# Altium schematic sheet LMAT_AMT_MAG.SchDoc
size C
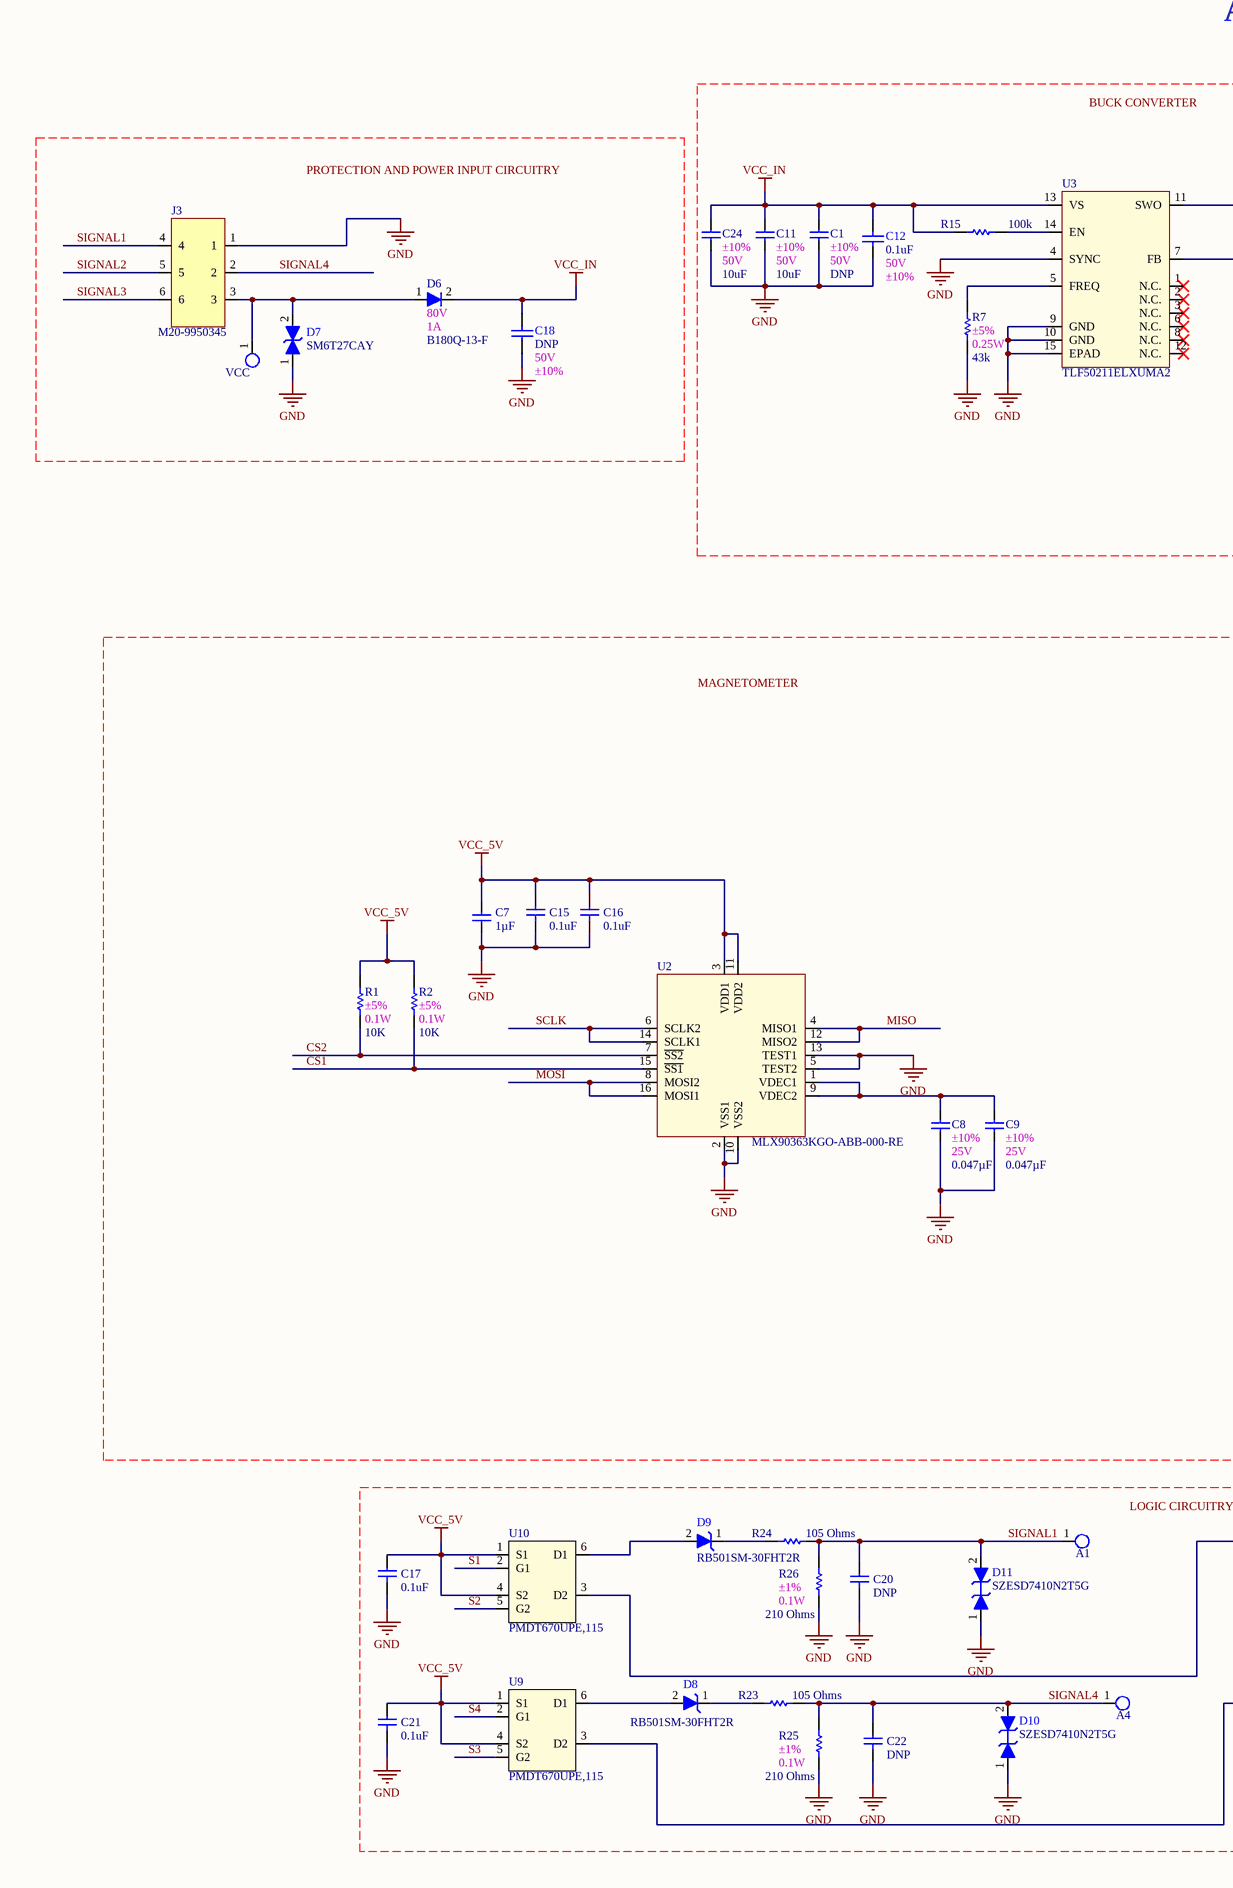
[diagram p0: LMAT_AMT_MAG.SchDoc, left]
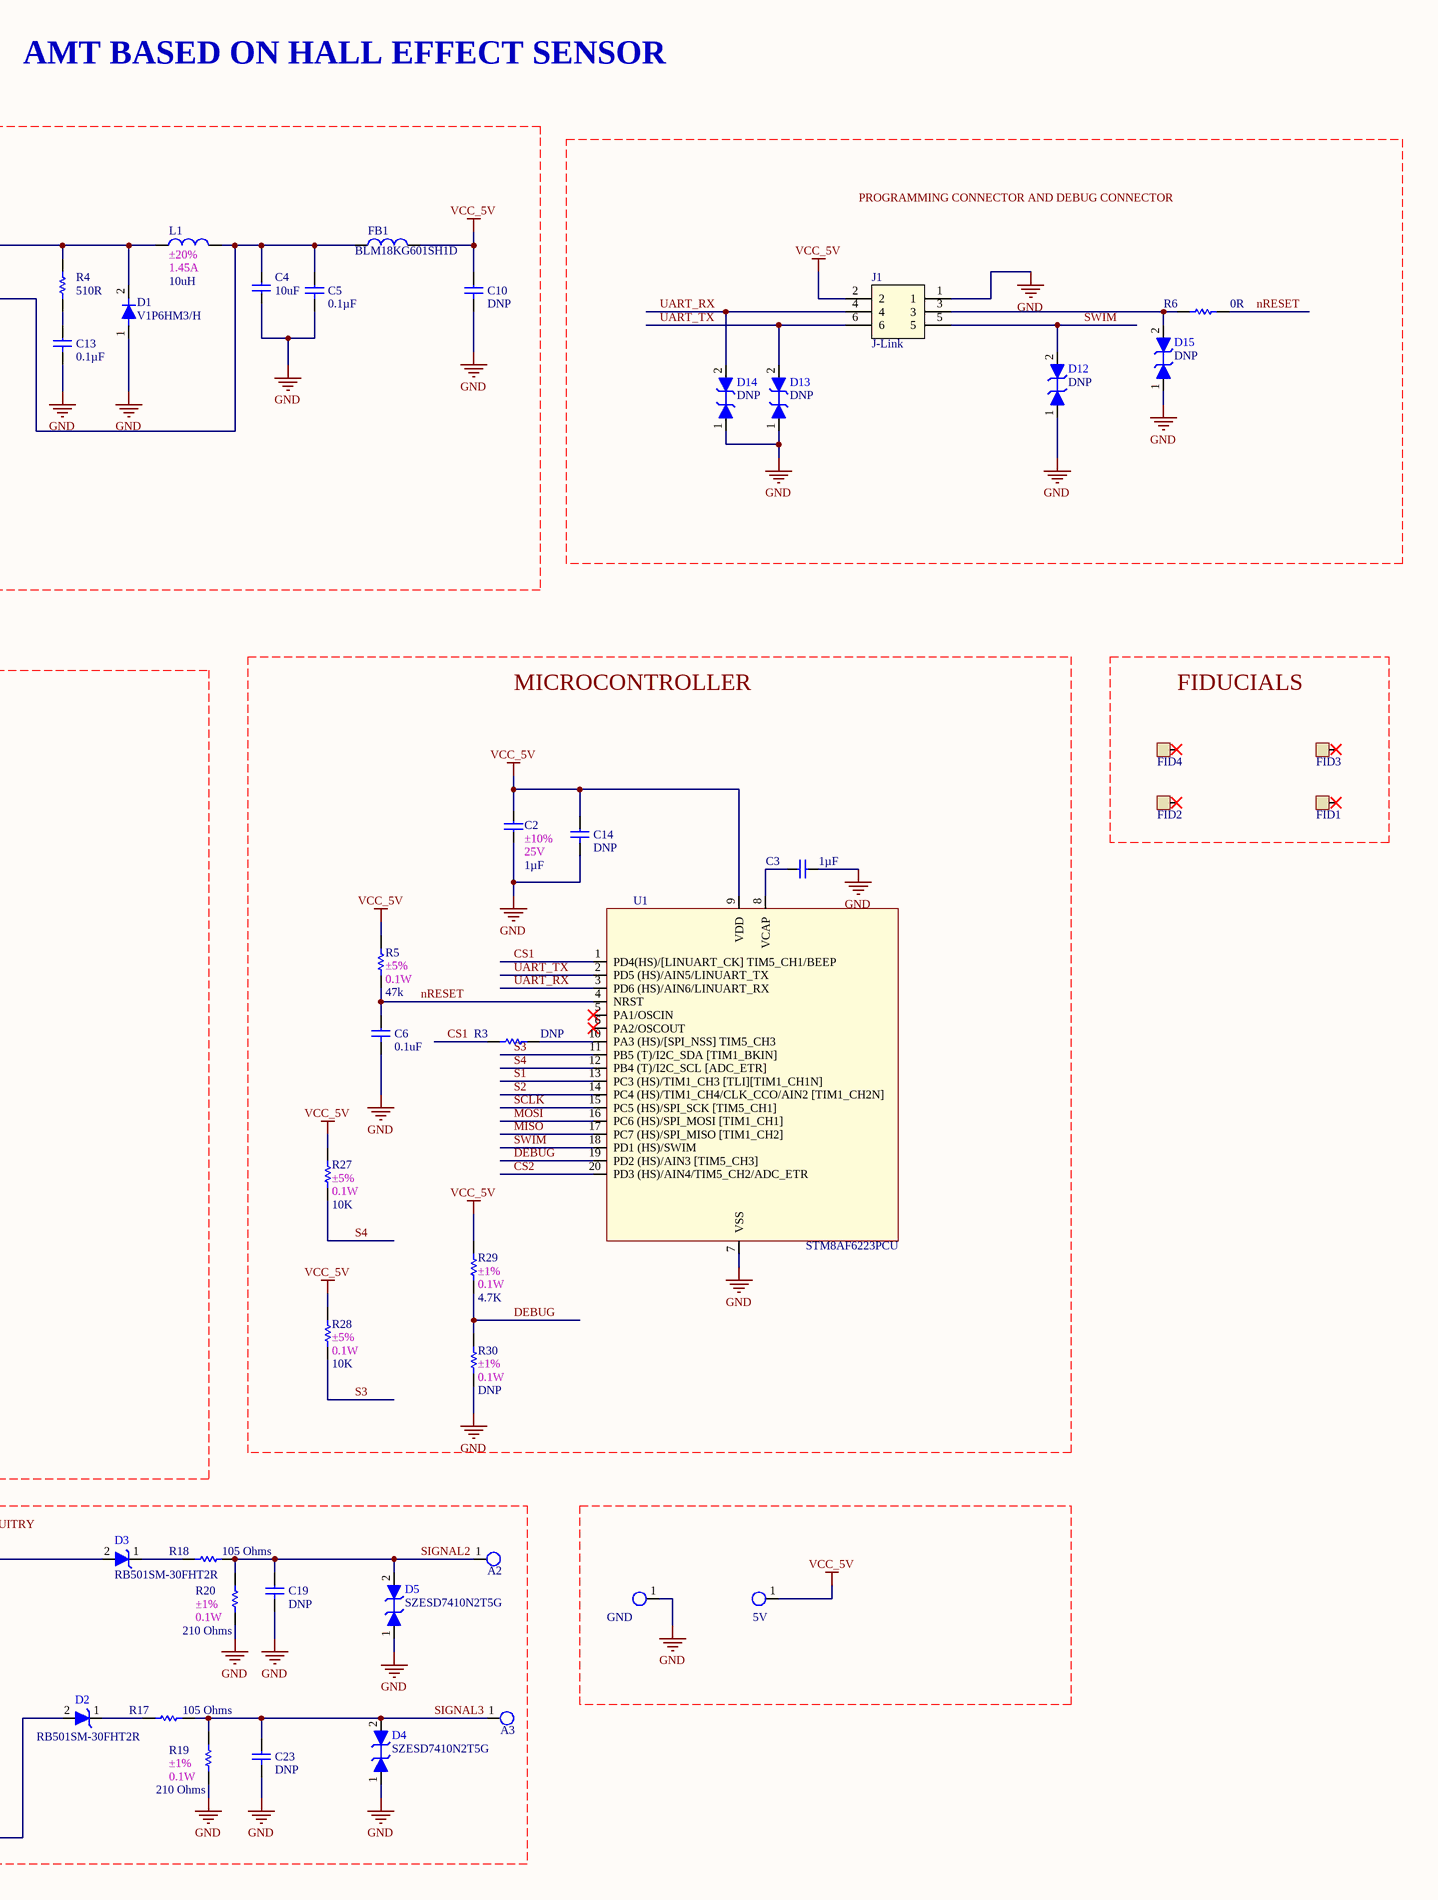
[diagram p1: LMAT_AMT_MAG.SchDoc, right]

## Parts
5V  Test Point- 35mil  [TP_35M_DIA]  (value not drawn)
A1  Test Point- 35mil  [TP_35M_DIA]  (value not drawn)
A2  Test Point- 35mil  [TP_35M_DIA]  (value not drawn)
A3  Test Point- 35mil  [TP_35M_DIA]  (value not drawn)
A4  Test Point- 35mil  [TP_35M_DIA]  (value not drawn)
C1  value DNP  2nd Auxiliary Field: ±10%  1st Auxiliary Field: 50V  [SMDC1210]  (hidden comment: CAP CER 10UF 50V X7R 1210)
C2  value 1µF  2nd Auxiliary Field: ±10%  1st Auxiliary Field: 25V  [SMDC0603]  (hidden comment: CAP CER 1UF 25V X7R 0603)
C3  value 1µF  [SMDC0603]  (hidden comment: CAP CER 1UF 25V X7R 0603)
C4  value 10uF  [SMDC1210]  (hidden comment: CAP CER 10UF 50V X7R 1210)
C5  value 0.1µF  [SMDC0402]  (hidden comment: CAP CER 0.1UF 16V X7R 0402)
C6  value 0.1uF  [SMDC0402]  (hidden comment: CAP CER 0.1UF 16V X7R 0402)
C7  value 1µF  [SMDC0603]  (hidden comment: CAP CER 1UF 25V X7R 0603)
C8  value 0.047µF  2nd Auxiliary Field: ±10%  1st Auxiliary Field: 25V  [SMDC0402]  (hidden comment: CAP CER 0.047UF 25V X7R 0402)
C9  value 0.047µF  2nd Auxiliary Field: ±10%  1st Auxiliary Field: 25V  [SMDC0402]  (hidden comment: CAP CER 0.047UF 25V X7R 0402)
C10  value DNP  [SMDC0402]  (hidden comment: CAP CER 0.1UF 16V X7R 0402)
C11  value 10uF  2nd Auxiliary Field: ±10%  1st Auxiliary Field: 50V  [SMDC1210]  (hidden comment: CAP CER 10UF 50V X7R 1210)
C12  value 0.1uF  1st Auxiliary Field: 50V  2nd Auxiliary Field: ±10%  [SMDC0603]  (hidden comment: CAP CER 0.1UF 50V 10% X7R 0603)
C13  value 0.1µF  [SMDC0402]  (hidden comment: CAP CER 0.1UF 16V X7R 0402)
C14  value DNP  [SMDC0402]  (hidden comment: CAP CER 0.1UF 16V X7R 0402)
C15  value 0.1uF  [SMDC0402]  (hidden comment: CAP CER 0.1UF 16V X7R 0402)
C16  value 0.1uF  [SMDC0402]  (hidden comment: CAP CER 0.1UF 16V X7R 0402)
C17  value 0.1uF  [SMDC0402]  (hidden comment: CAP CER 0.1UF 16V X7R 0402)
C18  value DNP  1st Auxiliary Field: 50V  2nd Auxiliary Field: ±10%  [SMDC0603]  (hidden comment: CAP CER 0.1UF 50V 10% X7R 0603)
C19  value DNP  [SMDC0402]  (hidden comment: CAP CER 0.1UF 16V X7R 0402)
C20  value DNP  [SMDC0402]  (hidden comment: CAP CER 0.1UF 16V X7R 0402)
C21  value 0.1uF  [SMDC0402]  (hidden comment: CAP CER 0.1UF 16V X7R 0402)
C22  value DNP  [SMDC0402]  (hidden comment: CAP CER 0.1UF 16V X7R 0402)
C23  value DNP  [SMDC0402]  (hidden comment: CAP CER 0.1UF 16V X7R 0402)
C24  value 10uF  2nd Auxiliary Field: ±10%  1st Auxiliary Field: 50V  [SMDC1210]  (hidden comment: CAP CER 10UF 50V X7R 1210)
D1  value V1P6HM3/H  [DIOM2213X07N]  (hidden comment: DIODE SCHOTTKY 60V 1A MICROSMP)
D2  value RB501SM-30FHT2R  [SOD1700X70N-V2]  (hidden comment: Diode Schottky 30V 100mA Surface Mount EMD2)
D3  value RB501SM-30FHT2R  [SOD1700X70N-V2]  (hidden comment: Diode Schottky 30V 100mA Surface Mount EMD2)
D4  value SZESD7410N2T5G  [DFN65P100X65X45-2N]  (hidden comment: TVS DIODE 5.5V 14V 2X1SON)
D5  value SZESD7410N2T5G  [DFN65P100X65X45-2N]  (hidden comment: TVS DIODE 5.5V 14V 2X1SON)
D6  value B180Q-13-F  1st Auxiliary Field: 80V  2nd Auxiliary Field: 1A  [DO460X292X240-2N]  (hidden comment: DIODE SCHOTTKY 80V 1A SMA)
D7  value SM6T27CAY  [DIOM4336X26B]  (hidden comment: TVS DIODE 23.1V 48.3V SMB)
D8  value RB501SM-30FHT2R  [SOD1700X70N-V2]  (hidden comment: Diode Schottky 30V 100mA Surface Mount EMD2)
D9  value RB501SM-30FHT2R  [SOD1700X70N-V2]  (hidden comment: Diode Schottky 30V 100mA Surface Mount EMD2)
D10  value SZESD7410N2T5G  [DFN65P100X65X45-2N]  (hidden comment: TVS DIODE 5.5V 14V 2X1SON)
D11  value SZESD7410N2T5G  [DFN65P100X65X45-2N]  (hidden comment: TVS DIODE 5.5V 14V 2X1SON)
D12  value DNP  [DFN65P100X65X45-2N]  (hidden comment: TVS DIODE 5.5V 14V 2X1SON)
D13  value DNP  [DFN65P100X65X45-2N]  (hidden comment: TVS DIODE 5.5V 14V 2X1SON)
D14  value DNP  [DFN65P100X65X45-2N]  (hidden comment: TVS DIODE 5.5V 14V 2X1SON)
D15  value DNP  [DFN65P100X65X45-2N]  (hidden comment: TVS DIODE 5.5V 14V 2X1SON)
FB1  value BLM18KG601SH1D  [SMDL0603]  (hidden comment: FERRITE BEAD 600 OHM 0603 1LN)
FID1  FID40X40  [FID40X40]  (value not drawn)
FID2  FID40X40  [FID40X40]  (value not drawn)
FID3  FID40X40  [FID40X40]  (value not drawn)
FID4  FID40X40  [FID40X40]  (value not drawn)
GND  Test Point- 35mil  [TP_35M_DIA]  (value not drawn)
J1  1st Auxiliary Field: J-Link  [PRG_8.06.16 J-LINK 6-PIN NEEDLE ADAPTER]  (hidden comment: J-LINK 6-PIN NEEDLE ADAPTER)
J3  Manufacturer Part Number: M20-9950345  [HDRRA6W86P254_2X3_1344X254X528P_Modified]  (hidden comment: CONN HEADER R/A 6POS 2.54MM)
L1  value 10uH  2nd Auxiliary Field: ±20%  1st Auxiliary Field: 1.45A  [IND_NRS5030T3R3MMGJ]  (hidden comment: FIXED IND 10UH 1.45A 144 MOHM)
R1  value 10K  2nd Auxiliary Field: ±5%  1st Auxiliary Field: 0.1W  [SMDR0402]  (hidden comment: RES SMD 10K OHM 5% 1/10W 0402)
R2  value 10K  2nd Auxiliary Field: ±5%  1st Auxiliary Field: 0.1W  [SMDR0402]  (hidden comment: RES SMD 10K OHM 5% 1/10W 0402)
R3  value DNP  [SMDR0402]  (hidden comment: RES SMD 0 OHM JUMPER 1/10W 0402)
R4  value 510R  [SMDR0402]  (hidden comment: RES SMD 510 OHM 5% 1/10W 0402)
R5  value 47k  2nd Auxiliary Field: ±5%  1st Auxiliary Field: 0.1W  [SMDR0402]  (hidden comment: RES SMD 47K OHM 5% 1/10W 0402)
R6  value 0R  [SMDR0402]  (hidden comment: RES SMD 0 OHM JUMPER 1/10W 0402)
R7  value 43k  2nd Auxiliary Field: ±5%  1st Auxiliary Field: 0.25W  [SMDR0805]  (hidden comment: RES 43K OHM 5% 1/4W 0805)
R15  value 100k  [SMDR0402]  (hidden comment: RES SMD 100K OHM 1% 1/10W 0402)
R17  value 105 Ohms  [SMDR0603]  (hidden comment: RES SMD 105 OHM 1% 1/10W 0603)
R18  value 105 Ohms  [SMDR0603]  (hidden comment: RES SMD 105 OHM 1% 1/10W 0603)
R19  value 210 Ohms  2nd Auxiliary Field: ±1%  1st Auxiliary Field: 0.1W  [SMDR0603]  (hidden comment: RES SMD 210 OHM 1% 1/10W 0603)
R20  value 210 Ohms  2nd Auxiliary Field: ±1%  1st Auxiliary Field: 0.1W  [SMDR0603]  (hidden comment: RES SMD 210 OHM 1% 1/10W 0603)
R23  value 105 Ohms  [SMDR0603]  (hidden comment: RES SMD 105 OHM 1% 1/10W 0603)
R24  value 105 Ohms  [SMDR0603]  (hidden comment: RES SMD 105 OHM 1% 1/10W 0603)
R25  value 210 Ohms  2nd Auxiliary Field: ±1%  1st Auxiliary Field: 0.1W  [SMDR0603]  (hidden comment: RES SMD 210 OHM 1% 1/10W 0603)
R26  value 210 Ohms  2nd Auxiliary Field: ±1%  1st Auxiliary Field: 0.1W  [SMDR0603]  (hidden comment: RES SMD 210 OHM 1% 1/10W 0603)
R27  value 10K  2nd Auxiliary Field: ±5%  1st Auxiliary Field: 0.1W  [SMDR0402]  (hidden comment: RES SMD 10K OHM 5% 1/10W 0402)
R28  value 10K  2nd Auxiliary Field: ±5%  1st Auxiliary Field: 0.1W  [SMDR0402]  (hidden comment: RES SMD 10K OHM 5% 1/10W 0402)
R29  value 4.7K  2nd Auxiliary Field: ±1%  1st Auxiliary Field: 0.1W  [SMDR0402]  (hidden comment: RES SMD 4.7K OHM 1% 1/10W 0402)
R30  value DNP  2nd Auxiliary Field: ±1%  1st Auxiliary Field: 0.1W  [SMDR0402]  (hidden comment: RES SMD 4.7K OHM 1% 1/10W 0402)
U1  value STM8AF6223PCU  [SOP65P640X120-20N]  (hidden comment: IC MCU 8BIT 8KB FLASH 20TSSOP)
U2  value MLX90363KGO-ABB-000-RE  [SOP65P640X120-16N]  (hidden comment: SENSOR HALL EFFECT SPI 16TSSOP)
U3  value TLF50211ELXUMA2  [SOP65P600X170_HS-15N]  (hidden comment: IC REG DC/DC CONVERTER)
U9  value PMDT670UPE,115  [SOTFL50P160X60-6N]  (hidden comment: MOSFET 2P-CH 20V 0.55A SOT666)
U10  value PMDT670UPE,115  [SOTFL50P160X60-6N]  (hidden comment: MOSFET 2P-CH 20V 0.55A SOT666)
VCC  Test Point- 35mil  [TP_35M_DIA]  (value not drawn)

## Nets
GND: C1.1 C2.1 C3.2 C4.1 C5.1 C6.1 C7.1 C8.1 C9.1 C10.1 C11.1 C12.2 C13.1 C14.1 C15.1 C16.1 C17.1 C18.2 C19.1 C20.1 C21.1 C22.1 C23.1 C24.1 D1.1(Anode) D4.1(ANODE) D5.1(ANODE) D7.1(ANODE) D10.1(ANODE) D11.1(ANODE) D12.1(ANODE) D13.1(ANODE) D14.1(ANODE) D15.1(ANODE) GND.1 J1.1 J3.1 R7.1 R19.2 R20.2 R25.2 R26.2 R30.1 U1.7(VSS) U2.2(VSS1) U2.5(TEST2) U2.10(VSS2) U2.13(TEST1) U3.4(SYNC) U3.9(GND) U3.10(GND) U3.15(EPAD)
VCC_5V: 5V.1 C2.2 C7.2 C10.2 C14.2 C15.2 C16.2 C17.2 C21.2 FB1.2 J1.2 R1.2 R2.2 R5.2 R27.2 R28.2 R29.2 U1.9(VDD) U2.3(VDD1) U2.11(VDD2) U9.1(S1) U9.4(S2) U10.1(S1) U10.4(S2)
VCC_IN: C1.2 C11.2 C12.1 C18.1 C24.2 D6.2(Cathode) R15.2 U3.13(VS)
CS1: R2.1 R3.1 U1.1(PD4(HS)/[LINUART_CK]_TIM5_CH1/BEEP) U2.15(~{SS1})
CS2: R1.1 U1.20(PD3_(HS)/AIN4/TIM5_CH2/ADC_ETR) U2.7(~{SS2})
DEBUG: R29.1 R30.2 U1.19(PD2_(HS)/AIN3_[TIM5_CH3])
MISO: U1.17(PC7_(HS)/SPI_MISO_[TIM1_CH2]) U2.4(MISO1) U2.12(MISO2)
MOSI: U1.16(PC6_(HS)/SPI_MOSI_[TIM1_CH1]) U2.8(MOSI2) U2.16(MOSI1)
nRESET: C6.2 R5.1 R6.2 U1.4(NRST)
S1: U1.13(PC3_(HS)/TIM1_CH3_[TLI][TIM1_CH1N]) U10.2(G1)
S2: U1.14(PC4_(HS)/TIM1_CH4/CLK_CCO/AIN2_[TIM1_CH2N]) U10.5(G2)
S3: R28.1 U1.11(PB5_(T)/I2C_SDA_[TIM1_BKIN]) U9.5(G2)
S4: R27.1 U1.12(PB4_(T)/I2C_SCL_[ADC_ETR]) U9.2(G1)
SCLK: U1.15(PC5_(HS)/SPI_SCK_[TIM5_CH1]) U2.6(SCLK2) U2.14(SCLK1)
SIGNAL1: A1.1 C20.2 D11.2(CATHODE) J3.4 R24.2 R26.1
SIGNAL2: A2.1 C19.2 D5.2(CATHODE) J3.5 R18.2 R20.1
SIGNAL3: A3.1 C23.2 D4.2(CATHODE) J3.6 R17.2 R19.1
SIGNAL4: A4.1 C22.2 D10.2(CATHODE) J3.2 R23.2 R25.1
SWIM: D12.2(CATHODE) J1.5 U1.18(PD1_(HS)/SWIM)
UART_RX: D14.2(CATHODE) J1.4 U1.3(PD6_(HS)/AIN6/LINUART_RX)
UART_TX: D13.2(CATHODE) J1.6 U1.2(PD5_(HS)/AIN5/LINUART_TX)
NetC3_1: C3.1 U1.8(VCAP)
NetC4_2: C4.2 C5.2 FB1.1 L1.2 U3.7(FB)
NetC8_2: C8.2 C9.2 U2.1(VDEC1) U2.9(VDEC2)
NetC13_2: C13.2 R4.1
NetD1_2: D1.2(Cathode) L1.1 R4.2 U3.11(SWO)
NetD2_1: D2.1(CATHODE) R17.1
NetD2_2: D2.2(ANODE) U9.3(D2)
NetD3_1: D3.1(CATHODE) R18.1
NetD3_2: D3.2(ANODE) U10.3(D2)
NetD6_1: D6.1(Anode) D7.2(CATHODE) J3.3 VCC.1
NetD8_1: D8.1(CATHODE) R23.1
NetD8_2: D8.2(ANODE) U9.6(D1)
NetD9_1: D9.1(CATHODE) R24.1
NetD9_2: D9.2(ANODE) U10.6(D1)
NetD15_2: D15.2(CATHODE) J1.3 R6.1
NetR3_2: R3.2 U1.10(PA3_(HS)/[SPI_NSS]_TIM5_CH3)
NetR7_2: R7.2 U3.5(FREQ)
NetR15_1: R15.1 U3.14(EN)

Not connected (* = marked no-connect by the designer): FID1 0*; FID2 0*; FID3 0*; FID4 0*; U1 5(PA1/OSCIN)* 6(PA2/OSCOUT)*; U3 1(N.C.)* 2(N.C.)* 3(N.C.)* 6(N.C.)* 8(N.C.)* 12(N.C.)*

## Notes on the sheet
- AMT BASED ON HALL EFFECT SENSOR
- BUCK CONVERTER
- PROTECTION AND POWER INPUT CIRCUITRY
- PROGRAMMING CONNECTOR AND DEBUG CONNECTOR
- MICROCONTROLLER
- FIDUCIALS
- MAGNETOMETER
- LOGIC CIRCUITRY

## Library data of the parts
5V A1-A4 GND VCC = EMS-TP35MIL-S: Internal Part Number: EMS-TP35MIL-S; Component Height (mm): *; Part Type: Test Point- 35mil; Vendor Name: *
C1 C11 C24 = ECA10U0L50V0-SH: Manufacturer: Taiyo Yuden; Vendor Part Number: 587-6026-1-ND; Manufacturer Part Number: UMJ325KB7106KMHP; Vendor Name: Digi-Key; 3rd Auxiliary Field: RoHS Compliant; 4th Auxiliary Field: AEC-Q200; Component Height (mm): 2.80mm; Temp Co: -55°C ~ 125°C; Part Type: CAP CER 10UF 50V X7R 1210; Internal Part Number: ECA10U0L50V0-SH
C2 = ECA1U00L25V0-SC: Manufacturer: TDK Corporation; Vendor Part Number: 445-173628-1-ND; Manufacturer Part Number: CGA3E1X7R1E105K080AE; Vendor Name: Digi-Key; 3rd Auxiliary Field: RoHS Compliant; Component Height (mm): 0.95mm; Temp Co: -55°C ~ 125°C; Part Type: CAP CER 1UF 25V X7R 0603; Internal Part Number: ECA1U00L25V0-SC; 4th Auxiliary Field: *
C3 C7 = ECA1U00L25V0-SC: Manufacturer: TDK Corporation; Vendor Part Number: 445-173628-1-ND; Manufacturer Part Number: CGA3E1X7R1E105K080AE; Vendor Name: Digi-Key; 3rd Auxiliary Field: RoHS Compliant; Component Height (mm): 0.95mm; Temp Co: -55°C ~ 125°C; 2nd Auxiliary Field: ±10%; Part Type: CAP CER 1UF 25V X7R 0603; Internal Part Number: ECA1U00L25V0-SC; 4th Auxiliary Field: *; 1st Auxiliary Field: 25V
C4 = ECA10U0L50V0-SH: Manufacturer: Taiyo Yuden; Vendor Part Number: 587-6026-1-ND; Manufacturer Part Number: UMJ325KB7106KMHP; Vendor Name: Digi-Key; 3rd Auxiliary Field: RoHS Compliant; 4th Auxiliary Field: AEC-Q200; Component Height (mm): 2.80mm; Temp Co: -55°C ~ 125°C; 2nd Auxiliary Field: ±10%; Part Type: CAP CER 10UF 50V X7R 1210; Internal Part Number: ECA10U0L50V0-SH; 1st Auxiliary Field: 50V
C5 C6 C10 C13-C17 C19-C23 = ECA0U10L16V0-SB: Manufacturer Part Number: GCM155R71C104KA55J; Manufacturer: Murata Electronics North America; Vendor Part Number: 490-7998-1-ND; Alternate Part number: GCM155R71C104KA55D; 3rd Auxiliary Field: RoHS Compliant; Component Height (mm): 0.55mm; Temp Co: -55°C ~ 125°C; 4th Auxiliary Field: AEC-Q200; Vendor Name: Digi-Key; 2nd Auxiliary Field: ±10%; Internal Part Number: ECA0U10L16V0-SB; Part Type: CAP CER 0.1UF 16V X7R 0402; 1st Auxiliary Field: 16V
C8 C9 = ECA47N0L25V0-SB: Manufacturer: Murata Electronics; Vendor Part Number: 490-4760-1-ND; Manufacturer Part Number: GCM155R71E473KA55D; Vendor Name: Digi-Key; 3rd Auxiliary Field: RoHS Compliant; Component Height (mm): 0.55mm; Temp Co: -55°C ~ 125°C; Part Type: CAP CER 0.047UF 25V X7R 0402; Internal Part Number: ECA47N0L25V0-SB; 4th Auxiliary Field: *
C12 C18 = ECA0U10K50V0-SC: Manufacturer Part Number: CGA3E2X7R1H104K080AA; Manufacturer: TDK Corporation; Vendor Part Number: 445-5666-1-ND; 3rd Auxiliary Field: RoHS Compliant; Component Height (mm): 0.90mm; Vendor Name: Digi-Key; Internal Part Number: ECA0U10K50V0-SC; Part Type: CAP CER 0.1UF 50V X7R 0603; Temp Co: X7R
D1 = EDDVS1A0060V0-S: Manufacturer: Vishay Semiconductor Diodes Division; Vendor Part Number: V1P6HM3/HGICT-ND; 3rd Auxiliary Field: RoHS Compliant; Temp Co: -40°C ~ 150°C; 4th Auxiliary Field: AEC-Q101; Vendor Name: Digi-Key; Component Height (mm): 0.73mm; Manufacturer Part Number: V1P6HM3/H; Internal Part Number: EDDVS1A0060V0-S; Part Type: DIODE SCHOTTKY 60V 1A MICROSMP; 1st Auxiliary Field: 60V; 2nd Auxiliary Field: 1A
D2 D3 D8 D9 = EDDR0A1030V0-S: Manufacturer: Rohm Semiconductor; Vendor Part Number: RB501SM-30FHT2RCT-ND; 3rd Auxiliary Field: RoHS Compliant; Component Height (mm): 0.70mm; Temp Co: 125°C (Max); Vendor Name: Digi-Key; Manufacturer Part Number: RB501SM-30FHT2R; Internal Part Number: EDDR0A1030V0-S; Part Type: Diode Schottky 30V 100mA Surface Mount EMD2; 4th Auxiliary Field: *; 2nd Auxiliary Field: 100mA; 1st Auxiliary Field: 30V
D4 D5 D10 D11 = EDDOS16A010V0-S: TVS DIODE 8V 20V 2X2DFN; Manufacturer: ON Semiconductor; Vendor Part Number: SZESD7410N2T5GOSCT-ND; 3rd Auxiliary Field: RoHS Compliant; Component Height (mm): 0.40mm; Temp Co: -55°C ~ 150°C (TJ); 4th Auxiliary Field: AEC-Q101; Vendor Name: Digi-Key; 2nd Auxiliary Field: 16A; 1st Auxiliary Field: 10V; Manufacturer Part Number: SZESD7410N2T5G; Internal Part Number: EDDOS16A010V0-S; Part Type: TVS DIODE 8V 20V 2X2DFN
D6 = EDDDI1A0080V0-S: Manufacturer: Diodes Incorporated; Vendor Part Number: B180Q-13-FDICT-ND; 3rd Auxiliary Field: RoHS Compliant; Temp Co: -65°C ~ 155°C; 4th Auxiliary Field: AEC-Q101; Vendor Name: Digi-Key; Component Height (mm): 2.40mm; Manufacturer Part Number: B180Q-13-F; Internal Part Number: EDDDI1A0080V0-S; Part Type: DIODE SCHOTTKY 80V 1A SMA
D7 = EDDST83A025V7-S: Manufacturer: STMicroelectronics; Vendor Part Number: 497-10798-1-ND; 3rd Auxiliary Field: RoHS Compliant; Component Height (mm): 2.65mm; Temp Co: -55°C ~ 150°C (TJ); Vendor Name: Digi-Key; 2nd Auxiliary Field: 600W; 1st Auxiliary Field: 25.7V; Manufacturer Part Number: SM6T27CAY; Internal Part Number: EDDST83A025V7-S; Part Type: TVS DIODE 23.1V 48.3V SMB; 4th Auxiliary Field: *
D12-D15 = EDDOS16A010V0-S: TVS DIODE 8V 20V 2X2DFN; Manufacturer Part Number: SZESD7410N2T5G; Manufacturer: ON Semiconductor; Vendor Part Number: SZESD7410N2T5GOSCT-ND; 3rd Auxiliary Field: RoHS Compliant; Component Height (mm): 0.40mm; Temp Co: -55°C ~ 150°C (TJ); 4th Auxiliary Field: AEC-Q101; Vendor Name: Digi-Key; 2nd Auxiliary Field: 16A; 1st Auxiliary Field: 10V; Internal Part Number: EDDOS16A010V0-S; Part Type: TVS DIODE 8V 20V 2X2DFN
FB1 = EIN600R1A30-S: Manufacturer: Murata Electronics North America; Vendor Part Number: 490-13259-1-ND; Vendor Name: Digi-Key; 3rd Auxiliary Field: RoHS Compliant; 4th Auxiliary Field: AEC-Q200; Component Height (mm): 0.95mm; Temp Co: -55°C ~ 125°C; 2nd Auxiliary Field: 1.3A; 1st Auxiliary Field: 150 mOhm; Part Type: FERRITE BEAD 600 OHM 0603 1LN; Manufacturer Part Number: BLM18KG601SH1D; Internal Part Number: EIN600R1A30-S
FID1-FID4 = FID_40X40
J1 = EMS-8.06.16 J-LINK 6-PIN NEEDLE ADAPTER: Manufacturer: Segger Microcontroller Systems; Vendor Part Number: 899-1051-ND; 3rd Auxiliary Field: RoHS Compliant; Vendor Name: Digi-Key; 2nd Auxiliary Field: *; 4th Auxiliary Field: *; Internal Part Number: EMS-8.06.16 J-LINK 6-PIN NEEDLE ADAPTER; Part Type: J-LINK 6-PIN NEEDLE ADAPTER; Temp Co: *; Manufacturer Part Number: 8.06.16 J-LINK 6-PIN NEEDLE ADAPTER; Value: 8.06.16 J-LINK 6-PIN NEEDLE ADAPTER
J3 = ECN-M20-9950345-0003-0060: Manufacturer: Harwin Inc.; Vendor Part Number: 952-2092-ND; 2nd Auxiliary Field: 2 rows; 3rd Auxiliary Field: RoHS Compliant; Component Height (mm): 5.08mm; Temp Co: -40°C ~ 105°C; Vendor Name: Digi-Key; 1st Auxiliary Field: 6pos; Internal Part Number: ECN-M20-9950345-0003-0060; Part Type: CONN HEADER R/A 6POS 2.54MM; Value: M20-9950345; 4th Auxiliary Field: *
L1 = EIN10U0N1A45-S: Manufacturer: Taiyo Yuden; Vendor Part Number: 587-3594-1-ND; Manufacturer Part Number: NRS5020T100MMGJV; Vendor Name: Digi-Key; 3rd Auxiliary Field: RoHS Compliant; 4th Auxiliary Field: AEC-Q200; Component Height (mm): 2.00mm; Temp Co: -40°C ~ 125°C; Part Type: FIXED IND 10UH 1.45A 144 MOHM; Internal Part Number: EIN10U0N1A45-S
R1 R2 R27 R28 = ERE10K0K110-SB: Manufacturer: Panasonic Electronic Components; Vendor Part Number: P10KJCT-ND; Manufacturer Part Number: ERJ-2GEJ103X; Vendor Name: Digi-Key; 3rd Auxiliary Field: RoHS Compliant; Component Height (mm): 0.40mm; Temp Co: ±200ppm/°C; Part Type: RES SMD 10K OHM 5% 1/10W 0402; Internal Part Number: ERE10K0K110-SB; 4th Auxiliary Field: *
R3 R6 = ERE0R00R110-SB: Manufacturer: Panasonic Electronic Components; Vendor Part Number: P0.0JCT-ND; Manufacturer Part Number: ERJ-2GE0R00X; Vendor Name: Digi-Key; 3rd Auxiliary Field: RoHS Compliant; 4th Auxiliary Field: AEC-Q200; Component Height (mm): 0.40mm; Temp Co: -55°C ~ 155°C; 1st Auxiliary Field: 0.1W; Part Type: RES SMD 0 OHM JUMPER 1/10W 0402; Internal Part Number: ERE0R00R110-SB; 2nd Auxiliary Field: Jumper
R4 = ERE510RK110-SB: Manufacturer: Panasonic Electronic Components; Vendor Part Number: P510JCT-ND; Manufacturer Part Number: ERJ-2GEJ511X; Alternate Part number: RK73B1ETTP511J; Vendor Name: Digi-Key; 3rd Auxiliary Field: RoHS Compliant; Component Height (mm): 0.40mm; Temp Co: -55°C ~ 155°C; 1st Auxiliary Field: 0.1W; Part Type: RES SMD 510 OHM 5% 1/10W 0402; Internal Part Number: ERE510RK110-SB; 4th Auxiliary Field: *; 2nd Auxiliary Field: ±5%
R5 = ERE47K0K110-SB: Manufacturer: Panasonic Electronic Components; Vendor Part Number: P47KJCT-ND; Manufacturer Part Number: ERJ-2GEJ473X; Vendor Name: Digi-Key; 3rd Auxiliary Field: RoHS Compliant; Component Height (mm): 0.40mm; Temp Co: ±200ppm/°C; Part Type: RES SMD 47K OHM 5% 1/10W 0402; Internal Part Number: ERE47K0K110-SB; 4th Auxiliary Field: *
R7 = ERE43K0K140-SE: Manufacturer: KOA Speer Electronics, Inc.; Vendor Part Number: 2019-RK73B2ATTD433JCT-ND; Manufacturer Part Number: RK73B2ATTD433J; Vendor Name: Digi-Key; 3rd Auxiliary Field: RoHS Compliant; 4th Auxiliary Field: AEC-Q200; Component Height (mm): 0.60mm; Temp Co: -55°C ~ 155°C; Part Type: RES 43K OHM 5% 1/4W 0805; Internal Part Number: ERE43K0K140-SE
R15 = ERE100KG110-SB: Manufacturer: Panasonic Electronic Components; Vendor Part Number: P100KLCT-ND; Manufacturer Part Number: ERJ-2RKF1003X; Alternate Part Number: ERJ-2GEJ104X; Vendor Name: Digi-Key; 3rd Auxiliary Field: RoHS Compliant; 4th Auxiliary Field: AEC-Q200; Component Height (mm): 0.40mm; Temp Co: ±100ppm/°C; 1st Auxiliary Field: 0.1W; Part Type: RES SMD 100K OHM 1% 1/10W 0402; Internal Part Number: ERE100KG110-SB; 2nd Auxiliary Field: ±1%
R17 R18 R23 R24 = ERE105RG110-SC: Manufacturer: Panasonic Electronic Components; Vendor Part Number: P105HCT-ND; Manufacturer Part Number: ERJ-3EKF1050V; Vendor Name: Digi-Key; 3rd Auxiliary Field: RoHS Compliant; 4th Auxiliary Field: AEC-Q200; Component Height (mm): 0.55mm; Temp Co: -55°C ~ 155°C; 1st Auxiliary Field: 0.1W; Part Type: RES SMD 105 OHM 1% 1/10W 0603; Internal Part Number: ERE105RG110-SC; 2nd Auxiliary Field: ±1%
R19 R20 R25 R26 = ERE210RG110-SC: Manufacturer: Panasonic Electronic Components; Vendor Part Number: P210HCT-ND; Manufacturer Part Number: ERJ-3EKF2100V; Vendor Name: Digi-Key; 3rd Auxiliary Field: RoHS Compliant; 4th Auxiliary Field: AEC-Q200; Component Height (mm): 0.55mm; Temp Co: -55°C ~ 155°C; Part Type: RES SMD 210 OHM 1% 1/10W 0603; Internal Part Number: ERE210RG110-SC
R29 R30 = ERE4K70G110-SB: Manufacturer: Panasonic Electronic Components; Vendor Part Number: P4.70KLCT-ND; Manufacturer Part Number: ERJ-2RKF4701X; Alternate Part Number: RK73H1ETTP4701F; Vendor Name: Digi-Key; 3rd Auxiliary Field: RoHS Compliant; 4th Auxiliary Field: AEC-Q200; Component Height (mm): 0.40mm; Temp Co: ±100ppm/°C; Part Type: RES SMD 4.7K OHM 1% 1/10W 0402; Internal Part Number: ERE4K70G110-SB
U1 = EICSTMTSSOP-20-1691: Manufacturer: STMicroelectronics; Vendor Part Number: 497-17896-ND; Component Height (mm): 1.2mm; 3rd Auxiliary Field: RoHS Compliant; Vendor Name: Digi-Key; Temp Co: -40°C ~ 125°C (TA); 2nd Auxiliary Field: 8-Bit; 1st Auxiliary Field: 3V ~ 5.5V; Manufacturer Part Number: STM8AF6223PCU; Part Type: IC MCU 8BIT 8KB FLASH 20TSSOP; 4th Auxiliary Field: *; Internal Part Number: EICSTMTSSOP-20-1691
U2 = EICMTTSSOP-16-1690: Manufacturer: Melexis Technologies NV; Vendor Part Number: MLX90363KGO-ABB-000-RECT-ND; Component Height (mm): 1.1mm; 3rd Auxiliary Field: RoHS Compliant; Vendor Name: Digi-Key; Temp Co: -40°C ~ 125°C (TA); 2nd Auxiliary Field: 15.5mA; 1st Auxiliary Field: 4.5V ~ 5.5V; Manufacturer Part Number: MLX90363KGO-ABB-000-RE; Part Type: SENSOR HALL EFFECT SPI 16TSSOP; 4th Auxiliary Field: *; Internal Part Number: EICMTTSSOP-16-1690
U3 = EICITLSSOP-14-1747: Manufacturer: Infineon Technologies; Vendor Part Number: TLF50211ELXUMA2CT-ND; Component Height (mm): 1.7mm; 3rd Auxiliary Field: RoHS Compliant; 4th Auxiliary Field: AEC-Q100; Vendor Name: Digi-Key; Temp Co: -40°C ~ 150°C (TJ); 2nd Auxiliary Field: 500mA; 1st Auxiliary Field: 45V; Manufacturer Part Number: TLF50211ELXUMA2; Part Type: IC REG DC/DC CONVERTER; Internal Part Number: EICITLSSOP-14-1747
U9 U10 = EICNUSOT666-06-0004: Manufacturer: Nexperia USA Inc.; Vendor Part Number: 1727-1334-1-ND; Component Height (mm): 0.6mm; 3rd Auxiliary Field: RoHS Compliant; 4th Auxiliary Field: AEC-Q101; Vendor Name: Digi-Key; Temp Co: -55°C ~ 150°C (TJ); 2nd Auxiliary Field: 550mA; Manufacturer Part Number: PMDT670UPE,115; Part Type: MOSFET 2P-CH 20V 0.55A SOT666; Internal Part Number: EICNUSOT666-06-0004; 1st Auxiliary Field: 20V